# EasyEDA Pro project SCH_QF-HEYE迷你热成像仪V1.1.5-24-6-29_2025-11-29.eprj

# Board PCB_主板-0402_2025-11-29
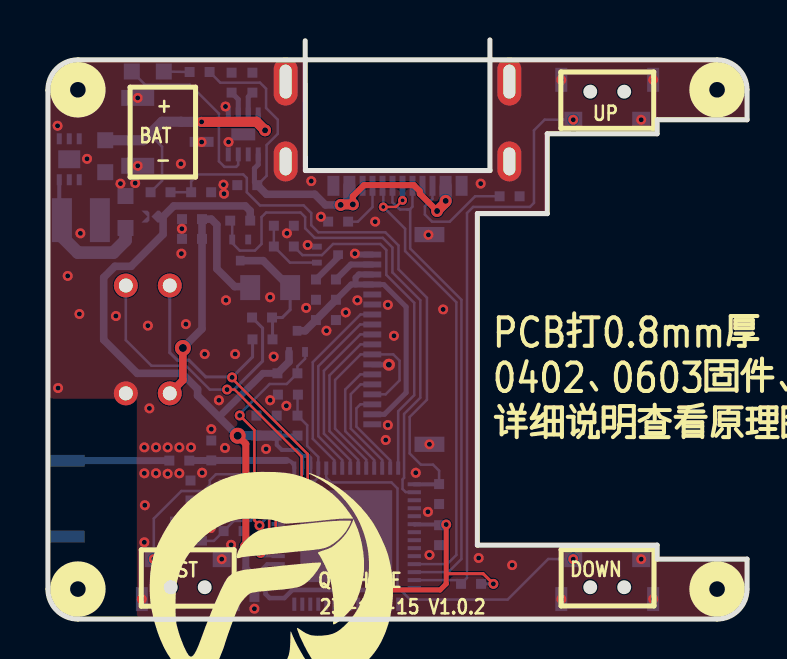
[diagram p0: board, top side]
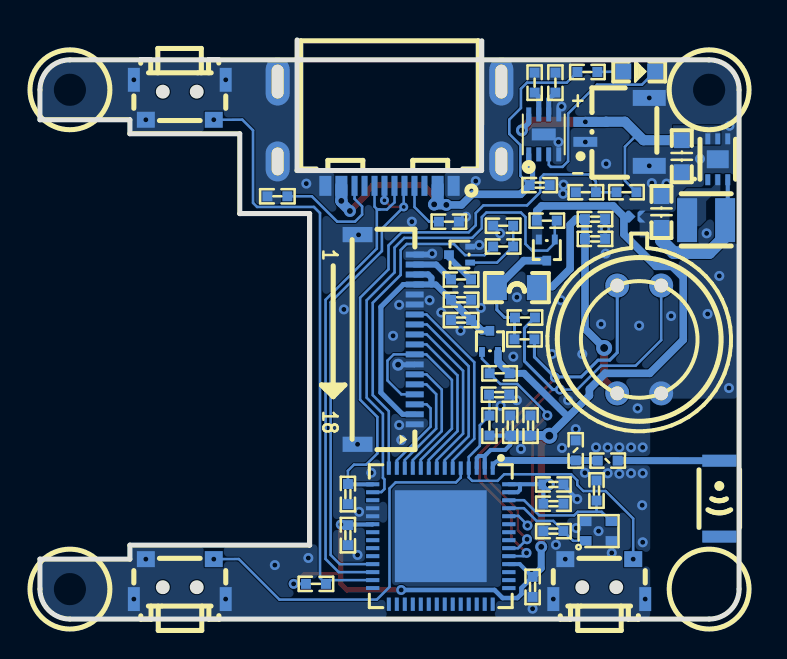
[diagram p1: board, bottom side, seen from below]

Outline 35 x 29 mm; copper layers: Top Layer, Bottom Layer. Coordinates in mm from the lower left corner of the outline.
Outline path: 0,26.48 arc(0.44,27.56) 1.52,28 33.5,28 arc(34.56,27.56) 35,26.5 35,25 30.5,25 30.5,24.3 25,24.3 25,20.3 21.5,20.3 21.5,3.7 30.5,3.7 30.5,3 35,3 35,1.5 arc(34.56,0.44) 33.5,0 1.5,0 arc(0.44,0.44) 0,1.5 0,26.48

## Design rules (mm)
via Default (default): diameter min 0.45, default 0.45, max 100.025; hole min 0.2, default 0.2, max 59.995
pour e378 uses gge41245
pour e379 uses gge65990
pour e512 uses gge41245(1)
pour e513 uses gge66092

## Placement (name value [footprint] x y rotation side)
C1  100nF  [CAP 0402]  7.21 19.03 180 bottom
C2  10uF  [CAP 0402]  7.21 20.02 180 bottom
C3  100nF  [CAP 0402]  13.92 15.99 180 bottom
C4  10uF  [CAP 0402]  13.92 14.97 0 bottom
C5  1uF  [CAP 0402]  9.98 21.73 180 bottom
C6  1uF  [CAP 0402]  12.01 11.24 180 bottom
C7  100nF  [CAP 0402]  10.44 9.69 90 bottom
C8  10uF  [CAP 0402]  11.46 9.69 90 bottom
C10  *  [CAP 0402]  9.3 4.4 0 bottom
C11  *  [CAP 0402]  7.14 6.44 270 bottom
C12  1uF  [CAP 0402]  9.3 5.78 0 bottom
C13  100nF  [CAP 0402]  10.34 1.61 270 bottom
C14  100nF  [CAP 0402]  19.58 6.26 270 bottom
C15  22u  [CAP 0603]  3.89 20.38 270 bottom
C16  100nF  [CAP 0402]  19.58 4.2 90 bottom
C17  22u  [CAP 0603]  2.87 23.17 90 bottom
C20  100nF  [CAP 0402]  9.3 6.74 0 bottom
CN3  SH1.0  [CONN-SMD_2P-P1.00_HDGC_HDGC1002WV-S-2P]  6.1 24.39 90 bottom
FPC3  0.5K-HX-18PWB  [FPC-SMD_18P-P0.50_HDGC_0.5K-HX-18PWB]  17.5 14 270 bottom
L2  -  [OA-C07]  0.99 6.03 270 bottom
L3  5.6nH  [L-0402]  6.58 7.93 0 bottom
L4  4.7nH  [L-0402]  8.18 8.44 90 bottom
L5  10uH  [0805-L]  11.12 16.6 0 bottom
L6  SWPA252012S4R7MT  [IND-SMD_L2.5-W2.0_SWPA252012S]  1.65 19.97 180 bottom
LED1  led-0603  [LED-0603]  5 27.42 0 bottom
Q1  CJ3134K  [SOT-723_L1.2-W0.8-P0.40-LS1.2-BR]  14 18.25 180 bottom
R1  1K  [RES-0402]  10.72 15.1 0 bottom
R2  1K  [RES-0402]  10.74 14 0 bottom
R3  6.2  [RES-0402]  11.81 18.65 180 bottom
R4  30k  [RES-0402]  11.81 19.69 0 bottom
R5  1K  [RES-0402]  7.59 27.39 180 bottom
R6  5.1K  [RES-0402]  14.53 19.9 180 bottom
R7  5.1K  [RES-0402]  23.11 21.17 180 bottom
R8  30k  [RES-0402]  21.18 1.76 0 bottom
R9  6.2  [RES-0402]  13.92 17 0 bottom
R11  300k  [RES-0402]  5.64 21.37 180 bottom
R12  30k  [RES-0402]  11.99 12.3 180 bottom
R13  30k  [RES-0402]  9.63 19.95 0 bottom
R14  680k  [RES-0402]  7.67 21.37 180 bottom
R15  62K  [RES-0402]  10.24 26.86 270 bottom
R16  470K  [RES-0402]  9.19 26.86 270 bottom
R55  10k  [RES-0402]  12.5 9.69 90 bottom
SW1  1TS003B  [KEY-SMD_1TS003B]  28 2 180 bottom
SW2  1TS003B  [KEY-SMD_1TS003B]  7 2 180 bottom
SW3  1TS003B  [KEY-SMD_1TS003B]  28 26 0 bottom
T1  SHORT_0.6  [SHORT-0.6]  5.23 20.15 0 bottom
U1  SGM6036-3.3  [UTDFN-6_L2.0-W1.5-P0.50-BL-EP]  1.07 23.02 180 bottom
U2  MLX90640ESF-BAB-000-TU  [TO-39-4_MELEXIS_MLX90640]  5 14 180 bottom
U3  ESP32-S3FH4R2  [QFN-56_L7.0-W7.0-P0.40-TL-EP4.6]  14.94 4.15 270 bottom
U4  CJ3139K  [SOT-723_L1.2-W0.8-P0.40-LS1.2-BR]  12.47 13.9 270 bottom
U6  CJ3139K  [SOT-723_L1.2-W0.8-P0.40-LS1.2-BR]  9.63 18.47 90 bottom
U7  SGM4056-6.8YTDE8G  [TDFN-8L_L2.0-W2.0-P0.50-BL-EP]  9.78 24.27 180 bottom
USB1  TYPE-C 16P CB0.8  [USB-C-SMD_TYPE-C-16P-CB0.8-073]  17.5 24.3 0 bottom
X1  40MHz  [2016_4P]  7.04 4.4 180 bottom

## Footprints (pads in the part's own frame, mm; a bottom-side part is the same pattern mirrored in y, then rotated)
0805-L
  rect 1x1.25 smd: 1(-1,0) 2(1,0)
2016_4P
  rect 0.575x0.475 smd: 1(-0.638,-0.488) 2(0.638,-0.488) 3(0.638,0.488) 4(-0.638,0.488)
CAP 0402
  rect 0.5x0.5 smd: 1(-0.5,0) 2(0.5,0)
CAP 0603
  rect 0.8x0.8 smd: 1(-0.8,0) 2(0.8,0)
CONN-SMD_2P-P1.00_HDGC_HDGC1002WV-S-2P
  rect 0.5x1.2 smd: 1(-0.5,1.6) 2(0.5,1.6)
  rect 0.8x1.651 smd: 3(1.7,-1.6) 4(-1.7,-1.6)
FPC-SMD_18P-P0.50_HDGC_0.5K-HX-18PWB
  rect 0.3x0.9 smd: 1(4.25,1.261) 2(3.75,1.261) 3(3.25,1.261) 4(2.75,1.261) 5(2.25,1.261) 6(1.75,1.261) 7(1.25,1.261) 8(0.75,1.261) 9(0.25,1.261) 10(-0.25,1.261) 11(-0.75,1.261) 12(-1.25,1.261) 13(-1.75,1.261) 14(-2.25,1.261) 15(-2.75,1.261) 16(-3.25,1.261) 17(-3.75,1.261) 18(-4.25,1.261)
  rect 0.762x1.5 smd: 19(-5.25,-1.6) 20(5.25,-1.6)
IND-SMD_L2.5-W2.0_SWPA252012S
  rect 1x2.2 smd: 1(-0.951,0) 2(0.951,0)
KEY-SMD_1TS003B
  rect 0.9x0.8 smd: 1(1.7,1) 2(-1.7,1)
  rect 0.6x1.2 smd: 3(-2.3,-1) 4(2.3,-1)
L-0402
  rect 0.5x0.5 smd: 1(-0.5,0) 2(0.5,0)
LED-0603
  rect 0.8x0.8 smd: 1(-0.8,0) 2(0.8,0)
OA-C07
  rect 0.6x1.7 smd: 1(-1.9,0) 2(1.9,0)
QFN-56_L7.0-W7.0-P0.40-TL-EP4.6
  rect 0.665x0.2 smd: 1(-3.408,2.6) 2(-3.408,2.2) 3(-3.408,1.8) 4(-3.408,1.4) 5(-3.408,1) 6(-3.408,0.6) 7(-3.408,0.2) 8(-3.408,-0.2) 9(-3.408,-0.6) 10(-3.408,-1) 11(-3.408,-1.4) 12(-3.408,-1.8) 13(-3.408,-2.2) 14(-3.408,-2.6) 29(3.408,-2.6) 30(3.408,-2.2) 31(3.408,-1.8) 32(3.408,-1.4) 33(3.408,-1) 34(3.408,-0.6) 35(3.408,-0.2) 36(3.408,0.2) 37(3.408,0.6) 38(3.408,1) 39(3.408,1.4) 40(3.408,1.8) 41(3.408,2.2) 42(3.408,2.6)
  rect 0.2x0.665 smd: 15(-2.599,-3.408) 16(-2.2,-3.408) 17(-1.8,-3.408) 18(-1.4,-3.408) 19(-1,-3.408) 20(-0.6,-3.408) 21(-0.2,-3.408) 22(0.2,-3.408) 23(0.6,-3.408) 24(1,-3.408) 25(1.401,-3.408) 26(1.8,-3.408) 27(2.2,-3.408) 28(2.6,-3.408) 43(2.6,3.408) 44(2.2,3.408) 45(1.8,3.408) 46(1.401,3.408) 47(1,3.408) 48(0.6,3.408) 49(0.2,3.408) 50(-0.2,3.408) 51(-0.6,3.408) 52(-1,3.408) 53(-1.4,3.408) 54(-1.8,3.408) 55(-2.2,3.408) 56(-2.599,3.408)
  rect 4.6x4.6 smd: 57(0,0)
RES-0402
  rect 0.5x0.5 smd: 1(-0.5,0) 2(0.5,0)
SHORT-0.6
  custom 0.4x0.6 smd: 1(-0.25,0)
  custom 0.5x0.6 smd: 2(0.25,0)
SOT-723_L1.2-W0.8-P0.40-LS1.2-BR
  rect 0.489x0.294 smd: 1(0.529,-0.4) 2(0.529,0.4)
  rect 0.489x0.434 smd: 3(-0.529,0)
TDFN-8L_L2.0-W2.0-P0.50-BL-EP
  rect 0.25x0.7 smd: 1(-0.75,-1) 2(-0.249,-1) 3(0.25,-1) 4(0.75,-1) 5(0.75,1) 6(0.25,1) 7(-0.249,1) 8(-0.75,1)
  rect 1.2x0.6 smd: 9(-0.001,-0.001)
TO-39-4_MELEXIS_MLX90640
  round 1.2 hole 0.7: 1(-1.1,2.7) 2(-1.1,-2.7) 3(1.1,-2.7) 4(1.1,2.7)
USB-C-SMD_TYPE-C-16P-CB0.8-073
  oval 1.2x2.4 hole 0.6x1.7: 0(-5.6,-2.611) 0(5.6,-2.611)
  oval 1.2x2 hole 0.6x1.4: 0(-5.6,1.389) 0(5.6,1.389)
  rect 0.6x1 smd: A1B12(-3.21,2.611) A4B9(-2.41,2.611) B1A12(3.21,2.611) B4A9(2.41,2.611)
  rect 0.3x1 smd: A5(-1.25,2.611) A6(-0.25,2.611) A7(0.251,2.61) A8(1.25,2.611) B5(1.75,2.611) B6(0.75,2.611) B7(-0.75,2.61) B8(-1.75,2.611)
UTDFN-6_L2.0-W1.5-P0.50-BL-EP
  rect 0.25x0.55 smd: 1(-0.5,-1.025) 2(-0.001,-1.025) 3(0.5,-1.025) 4(0.5,1.025) 5(-0.001,1.025) 6(-0.5,1.025)
  rect 1.1x0.9 smd: 7(-0.001,0)

## Nets
3V3: C7.1 C8.1 C12.2 C13.1 C16.2 C20.2 R8.2 R12.2 R13.2 R55.1 T1.2 U3.2 U3.3 U3.20 U3.46 U3.55 U3.56 U4.2 U6.2
+5V: C5.1 R5.1 U7.1 USB1.A4B9 USB1.B4A9
GND: C1.2 C2.2 C3.2 C4.2 C5.2 C6.2 C7.2 C8.2 C10.2 C11.1 C12.1 C13.2 C14.2 C15.1 C16.1 C17.1 C20.1 CN3.1 CN3.3 CN3.4 FPC3.1 FPC3.7 FPC3.13 FPC3.14 FPC3.18 FPC3.19 FPC3.20 L4.2 Q1.2 R4.2 R6.2 R7.1 R14.1 R15.1 R16.1 SW1.2 SW1.3 SW1.4 SW2.2 SW2.3 SW2.4 SW3.1 SW3.3 SW3.4 U1.4 U1.7 U2.3 U3.18 U3.19 U3.57 U7.4 U7.5 U7.9 USB1.0 USB1.A1B12 USB1.B1A12 X1.2 X1.4
ADC: C14.1 R11.1 R14.2 U3.15
BAT: C17.2 CN3.2 R11.2 U1.5 U1.6 U7.8
BLK: R3.1 U3.14
C1_1: C1.1 C2.1 L5.1 U2.2
C3_1: C3.1 C4.1 FPC3.2 FPC3.15 FPC3.16 U4.3
C15_2: C15.2 L6.2 T1.1 U1.3
CAM_VDD: R13.1 U3.16 U6.1
CHA: LED1.1 U7.3
CS: FPC3.11 U3.7
DC: FPC3.12 U3.6
FPC3_17: FPC3.17 R9.2
IO0: SW1.1 U3.5
KEY: R8.1 SW3.2 U3.27
L3_1: L2.1 L3.1
L6_1: L6.1 U1.2
L_RST: FPC3.4 FPC3.8 U3.10
LCD_VDD: R12.1 U3.52 U4.1
LNA: L3.2 L4.1 U3.1
MOSI: FPC3.9 U3.9
Q1_1: Q1.1 R3.2 R4.1
Q1_3: Q1.3 R9.1
R1_2: L5.2 R1.2 R2.2 U6.3
R5_2: LED1.2 R5.2
RST: C6.1 R55.2 SW2.1 U3.4
SCL: R1.1 U2.4 U3.48
SCLK: FPC3.10 U3.8
SDA: R2.1 U2.1 U3.47
TP_INT: FPC3.3 U3.13
TP_SCL: FPC3.6 U3.11
TP_SDA: FPC3.5 U3.12
U7_6: R16.2 U7.6
U7_7: R15.2 U7.7
USB1_A5: R6.1 USB1.A5
USB1_B5: R7.2 USB1.B5
USB_D+: U3.26 USB1.A6 USB1.B6
USB_D-: U3.25 USB1.A7 USB1.B7
XTAL_N: C10.1 U3.53 X1.1
XTAL_P: C11.2 U3.54 X1.3

Pads without a net: L2 2; U1 1; U3 17 21 22 23 24 28 29 30 31 32 33 34 35 36 37 38 39 40 41 42 43 44 45 49 50 51; U7 2; USB1 A8 B8

## Via types
v1: diameter 0.5, hole 0.25, Top Layer to Bottom Layer, 96 vias
v2: diameter 0.8, hole 0.4, Top Layer to Bottom Layer, 2 vias
v3: diameter 0.6, hole 0.3, Top Layer to Bottom Layer, 8 vias
v4: diameter 0.45, hole 0.2, Top Layer to Bottom Layer, 2 vias

## Routing (per net, layer and track width the routed paths; a pad name or vN(x,y) marks a point on that pad's centre or on a via; arc(x,y) is an arc through that point)
3V3: length 66.2
  Top Layer w0.152: 19.94,1.97 19.94,2.27 21.79,2.27 v1(22.3,1.76)
  Top Layer w0.254: v1(16.92,1.46) 19.63,1.46 19.94,1.76 v1(19.94,4.73)
  Top Layer w0.349: v3(9.91,3.62) 9.91,6.36 v3(9.53,6.74) 9.91,7.12 9.91,8.77 v2(9.5,9.18)
  Bottom Layer w0.152: R8.2 v1(22.3,1.76)
  Bottom Layer w0.203: R55.1 C8.1 11.46,8.72 11.71,8.47 12.44,8.47 12.74,8.17 ; 12.74,8.17 U3.2 ; 12.74,8.17 12.66,8.25 ; 12.74,8.17 13.03,8.17 13.13,8.06 13.13,7.56 ; 11.53,6.35 11.08,6.35 10.97,6.47 10.97,6.75 ; v1(19.94,4.73) 18.36,4.73 18.34,4.75 ; U3.56 9.53,6.75 v3(9.53,6.74) C20.2 C12.2 ; U3.46 10.98,2.75 C13.1
  Bottom Layer w0.229: v1(16.92,1.46) 12.24,1.46 11.84,1.05 11.1,1.05 10.9,1.25 10.9,1.55 C13.1
  Bottom Layer w0.254: 19.58,4.75 19.6,4.73 v1(19.94,4.73)
  Bottom Layer w0.349: v3(9.91,3.62) 9.91,2.54 C13.1 ; C20.2 v3(9.53,6.74) ; 8.61,10.17 10.77,12.3 R12.2
  Bottom Layer w0.381: R12.2 12.07,12.88 12.07,13.37 ; 10.13,19.95 10.13,20.44 9.88,20.69 6.3,20.69 5.77,20.15 5.77,19.26 4.17,17.66 3.35,17.66 2.79,17.1 2.79,13.98 4.47,12.3 6.71,12.3 7.49,11.52 7.49,11.19 v2(9.5,9.18)
  Bottom Layer w0.457: C7.1 9.51,9.19 v2(9.5,9.18)
  Bottom Layer w0.508: C8.1 C7.1
+5V: length 25.4
  Top Layer w0.305: v3(15.27,20.76) 15.27,21.17 15.82,21.73 18.31,21.73 18.62,21.42 18.62,21.29 v3(19.48,20.43)
  Top Layer w0.508: v3(15.27,20.76) 14.68,20.76 v3(14.66,20.74) ; v3(19.48,20.43) 19.91,20.86 v3(19.91,20.94)
  Bottom Layer w0.127: 8.09,27.39 8.63,26.86 10.62,26.86 10.92,26.55 10.92,25.59 11.51,25 11.51,24.29 10.95,23.73 10.95,22.19 C5.1
  Bottom Layer w0.254: U7.1 10.53,22.75 10.34,22.56 10.34,21.87 C5.1
  Bottom Layer w0.305: v3(14.66,20.74) 14.68,20.76 v3(15.27,20.76)
  Bottom Layer w0.381: v3(14.66,20.74) 13.89,20.74 13.36,21.27 10.94,21.27 C5.1
  Bottom Layer w0.508: v3(15.27,20.76) 14.68,20.76 v3(14.66,20.74) ; v3(19.91,20.94) 19.91,20.86 v3(19.48,20.43)
  Bottom Layer w0.61: 15.09,21.69 15.09,20.94 v3(15.27,20.76) ; v3(19.91,20.94) 19.91,20.94 19.91,21.69
GND: length 2.8
  Bottom Layer w0.203: v1(8.1,6) 8.8,6.7 C20.1
  Bottom Layer w0.254: FPC3.7 16.25,12.73 v3(17.07,12.73)
  Bottom Layer w0.305: 16.24,18.25 15.37,18.25 v1(15.37,18.3)
  vias: v1(0.48,24.7) v1(0.51,11.57) v1(0.99,17.18) v1(1.63,19.31) v1(1.57,15.27) v1(1.96,23.04) v1(3.4,15.17) v1(3.63,21.8) v1(4.37,21.83) v1(4.5,26.09) v1(4.5,22.69) v1(4.7,1) v1(4.83,8.59) v1(4.83,7.3) v1(4.83,3.84) v1(4.85,5.7) v1(5,14.69) v1(5.08,10.55) v1(5.41,8.59) v1(5.41,7.3) v1(5.99,8.59) v1(5.99,7.27) v1(6.38,3.31) v1(6.58,8.59) v1(6.58,7.3) v1(6.66,22.79) v1(6.71,19.54) v1(6.68,18.3) v1(6.91,14.77) v1(7.04,4.4) v1(7.16,8.59) v1(7.7,23.89) v1(7.72,7.32) v1(7.85,13.27) v1(8.18,9.51) v1(8.15,4.56) v1(8.56,10.96) v1(8.7,3) v1(8.79,21.75) v1(8.81,21.29) v1(8.89,25.66) v1(8.92,15.96) v1(8.86,8.57) v1(9.04,23.89) v1(9.17,3.72) v1(9.3,1) v1(9.37,13.27) v1(10.34,0.52) v1(10.92,8.52) v1(11.12,16.11) v1(11.12,10.96) v1(11.3,13.14) v1(11.94,10.68) v1(11.96,19.31) v1(12.93,15.58) v1(13,18.73) v1(13.18,21.93) v1(13.66,20.14) v1(13.94,14.44) v1(14.91,15.35) v1(15.49,15.96) v1(16.38,19.9) v1(16.91,8.97) v1(17.02,15.73) v1(17.02,9.71) v1(17.32,14.18) v1(18.41,7.32) v1(19.02,5.37) v1(19.05,19.24) v1(19.1,8.75) v1(19.1,3.21) v1(19.79,15.5) v1(21.56,3.06) v1(21.67,21.8) v1(23.24,2.7) v1(25.7,27) v1(25.71,1) v1(29.7,25) v1(29.7,3) v1(30.3,27) v1(30.3,1)
ADC: length 29.4
  Bottom Layer w0.127: 6.14,21.37 7.17,21.37 7.17,21.91 7.52,22.26 9.78,22.26 9.96,22.08 9.96,21.37 10.62,20.71 12.8,20.71 13.18,20.33 13.18,19.72 13.54,19.36 16.89,19.36 17.55,18.7 17.55,17.51 18.97,16.09 18.97,10.98 18.11,10.12 18.11,8.29 18.67,7.73 19.28,7.73 19.58,7.43 C14.1
  Bottom Layer w0.203: 18.34,6.74 19.58,6.75
BAT: length 12.9
  Top Layer w0.508: v3(10.87,24.47) 10.44,24.9 v1(7.7,24.89)
  Bottom Layer w0.127: 5.09,24.28 5.72,23.65 5.72,21.95 5.14,21.37
  Bottom Layer w0.254: v3(10.87,24.47) 10.87,24.49 10.53,24.84 U7.8
  Bottom Layer w0.508: v1(7.7,24.89) 6.66,24.89 6.66,24.9 5.72,24.9 4.79,23.97 C17.2
BLK: length 17
  Bottom Layer w0.127: R3.1 12.74,18.22 13.72,18.22 14.28,18.78 16.64,18.78 16.94,18.47 16.94,17.23 18.34,15.83 18.34,11.21 17.54,10.41 U3.14
C1_1: length 14.5
  Top Layer w0.381: U2.2 6.76,11.96 v2(6.76,13.57)
  Bottom Layer w0.381: v2(6.76,13.57) 7.71,14.53 C1.1 C2.1 8.18,20.02 8.46,19.75 8.46,17.53 9.35,16.65 10.07,16.65 L5.1
C3_1: length 14.6
  Bottom Layer w0.254: 16.24,10.25 16.85,10.25 17.93,11.34 17.93,15.63 16.81,16.75 16.24,16.75
  Bottom Layer w0.305: C3.1 15.18,16.75 16.24,16.75 ; 15.4,16.75 15.4,17.09 15.57,17.26 16.24,17.25
  Bottom Layer w0.381: U4.3 12.88,14.43 C4.1 C3.1
C15_2: length 7.3
  Bottom Layer w0.203: L6.2 0.57,20.11 U1.3
  Bottom Layer w0.635: L6.2 0.7,19.15 1.5,18.35 3.28,18.35 3.89,18.96 C15.2
CAM_VDD: length 25.7
  Bottom Layer w0.127: R13.1 9.23,19.95 U6.1 9.23,18.83 9.6,18.45 10.36,18.45 10.69,18.78 10.69,20.13 10.92,20.35 12.65,20.35 12.88,20.13 12.88,19.57 13.36,19.08 16.76,19.08 17.25,18.6 17.25,17.36 18.64,15.96 18.64,11.08 17.83,10.27 17.83,7.07 17.75,6.99 17.75,6.51 17.91,6.36 18.34,6.35
CHA: length 9.3
  Bottom Layer w0.127: U7.3 9.53,22.74 9.42,22.64 8.84,22.64 8.56,22.92 8.56,25.31 7.11,26.76 4.86,26.76 LED1.1
CS: length 9.2
  Bottom Layer w0.127: 14.73,7.56 14.73,7.96 13.54,9.15 13.54,12.66 15.63,14.75 16.24,14.75
DC: length 9.7
  Bottom Layer w0.127: U3.6 14.34,7.95 13.26,9.03 13.26,12.86 15.65,15.25 16.24,15.25
FPC3_17: length 2.1
  Bottom Layer w0.305: R9.2 15.17,17.75 FPC3.17
IO0: length 19.1
  Bottom Layer w0.127: v1(26.3,3) 25.04,3.01 23.01,0.97 18.14,0.97 17.5,1.61 17.5,6.54 17.2,6.84 14.17,6.84 13.93,7.08 13.93,7.56
KEY: length 30.5
  Bottom Layer w0.127: 18.34,1.95 20.5,1.95 R8.1 20.98,2.06 20.98,20.33 21.28,20.63 24.13,20.63 24.33,20.84 24.33,24.47 24.87,25 v1(26.3,25)
L3_1: length 5.1
  Bottom Layer w0.349: L3.1 L2.1
L_RST: length 11.6
  Bottom Layer w0.127: U3.10 15.94,7.97 14.38,9.53 14.38,11.97 15.65,13.25 17.29,13.25 17.6,12.94 17.6,11.95 16.91,11.25 16.24,11.25
LCD_VDD: length 12.1
  Top Layer w0.127: v1(10.59,4.68) 10.34,4.94 10.34,9.46 v1(9.6,10.19)
  Bottom Layer w0.127: v1(10.59,4.68) 10.59,4.71 11.05,5.17 U3.52 ; U4.1 12.87,13.03 12.49,12.65 R12.1 11.96,11.77 11.1,11.77 9.6,10.27 v1(9.6,10.19)
LNA: length 5.5
  Bottom Layer w0.203: U3.1 arc(12.22,7.83) 11.95,7.94
  Bottom Layer w0.349: 11.95,7.94 L4.1 7.08,7.93
MOSI: length 8
  Bottom Layer w0.127: 16.24,13.75 15.65,13.75 14.1,12.2 14.1,9.41 15.53,7.97 15.53,7.56
Q1_1: length 3.5
  Bottom Layer w0.127: Q1.1 12.12,17.85 R3.2 ; 11.31,19.69 11.31,18.65
Q1_3: length 1.7
  Bottom Layer w0.305: R9.1 14.53,18.11 Q1.3
R1_2: length 6.3
  Bottom Layer w0.152: R2.2 11.24,15.07 R1.2 11.74,15.1 12.13,15.49 12.13,16.6
  Bottom Layer w0.381: L5.2 10.78,17.95 U6.3
R5_2: length 1.3
  Bottom Layer w0.127: R5.2 LED1.2
RST: length 16.1
  Bottom Layer w0.127: v1(5.3,3) 5.3,5.03 6.68,6.41 7.8,6.41 8.1,6.72 8.1,6.94 8.41,7.25 11.76,7.25 12.09,6.92 13.36,6.92 13.54,7.09 U3.4 13.54,8.11 12.98,8.67 12.98,9.7 12.5,10.19 ; R55.2 12.5,11.22 C6.1
SCL: length 24.8
  Top Layer w0.127: v1(8.97,11.49) 9.35,11.49 12.7,8.14 12.7,7.1 11.07,5.47 11.07,4.45 v1(10.62,4)
  Bottom Layer w0.127: 11.53,3.55 11.06,3.55 v1(10.62,4) ; v1(8.97,11.49) 8.1,11.49 6.91,12.68 5.18,12.68 3.9,13.97 U2.4
  Bottom Layer w0.152: R1.1 10.75,14.57 10.75,12.91 9.32,11.49 v1(8.97,11.49)
SCLK: length 8.6
  Bottom Layer w0.127: 16.24,14.25 15.64,14.25 13.82,12.43 13.82,9.28 15.14,7.96 U3.8
SDA: length 21.6
  Top Layer w0.127: v1(9.22,12.1) 9.22,12.05 13,8.26 13,6.92 11.4,5.32 11.4,4.07 v1(10.64,3.31)
  Bottom Layer w0.127: v1(10.64,3.31) 10.8,3.15 U3.47
  Bottom Layer w0.152: R2.1 10.24,13.12 v1(9.22,12.1) 9.19,12.12 7.9,12.12 7.06,12.96 6.48,12.96 6.1,13.34 U2.1
TP_INT: length 4.6
  Bottom Layer w0.127: 16.24,10.75 15.64,10.75 15.44,10.55 15.44,9.64 17.13,7.94 U3.13
TP_SCL: length 6.2
  Bottom Layer w0.127: 16.24,12.25 15.64,12.25 14.88,11.49 14.88,9.41 16.33,7.96 16.33,7.56
TP_SDA: length 5.6
  Bottom Layer w0.127: U3.12 16.74,7.96 15.16,9.53 15.16,11.26 15.65,11.75 16.24,11.75
U7_6: length 1.2
  Bottom Layer w0.254: U7.6 9.53,26.02 R16.2
U7_7: length 1.2
  Bottom Layer w0.254: U7.7 10.03,26.15 R15.2
USB1_A5: length 2.8
  Bottom Layer w0.127: 16.25,21.86 16.25,20.63 15.52,19.9 R6.1
USB1_B5: length 6.2
  Bottom Layer w0.127: 19.25,21.86 19.25,21.04 18.87,20.66 18.87,20.25 19.23,19.9 20.12,19.9 21.39,21.17 R7.2
USB_D+: length 24.8
  Bottom Layer w0.127: 18.25,21.86 18.25,20.65 18.11,20.51 17.98,20.51 ; 18.34,2.35 20.04,2.35 20.7,3.01 20.7,15.99 18.14,18.55 18.14,20.51 17.63,20.51 17.25,20.86 17.25,21.86
USB_D-: length 24.5
  Top Layer w0.127: v4(16.79,20.63) 17.42,20.63 v4(17.75,20.96)
  Bottom Layer w0.127: 16.75,21.86 16.79,21.82 v4(16.79,20.63) 17.88,19.54 17.88,18.42 20.45,15.86 20.45,3.21 19.99,2.75 18.34,2.75
  Bottom Layer w0.152: v4(17.75,20.96) 17.75,21.86 17.75,21.86
XTAL_N: length 4.5
  Bottom Layer w0.127: X1.1 8.31,3.92 C10.1 9.3,4.91 10.13,4.91 10.77,5.55 11.53,5.55
XTAL_P: length 6.3
  Bottom Layer w0.127: X1.3 6.88,5.37 8.08,5.37 8.25,5.19 10.01,5.19 10.77,5.95 U3.54 ; C11.2 7.13,5.37

## Copper pours and planes (outline as drawn; the poured copper is in the pictures)
GND on Top Layer: -1.27,29.78 35.48,29.78 36.55,30.84 36.55,-2.4 35.76,-3.19 0.86,-3.19 -2.34,0.01
GND on Bottom Layer: -2.1,30.63 37.02,30.63 37.81,29.84 37.81,-0.18 35.22,-2.77 -0.09,-2.77 -2.1,-0.77
1111 on Top Layer: 0,-0.17 0,10.98 4.34,10.98 4.39,10.93 4.39,-0.09
1111 on Bottom Layer: 0,-0.17 0,10.98 4.34,10.98 4.39,10.93 4.39,-0.09
BAT on Bottom Layer: 0.94,24.72 3.3,24.72 3.3,23.76 0.94,23.76
C15_2 on Bottom Layer: 3.48,20.35 4.98,20.35 4.98,19.11 3.48,19.11
L6_1 on Bottom Layer: 0.94,22.28 3.12,22.28 3.12,19.67 0.94,19.67

Small or netless copper shapes (teardrops, artwork), in the pictures only: 1 on Bottom Layer

## Text on the board
Bottom Silkscreen Layer: 1 | 18 | + | -
Top Silkscreen Layer: BAT | - | + | RST | QF-HEYE | 23-12-15 V1.0.2 | DOWN | UP | 0402、0603固件、外壳通用 | PCB打0.8mm厚 | 详细说明查看原理图和用户手册！

# Board PCB_主板-0603_2025-11-29
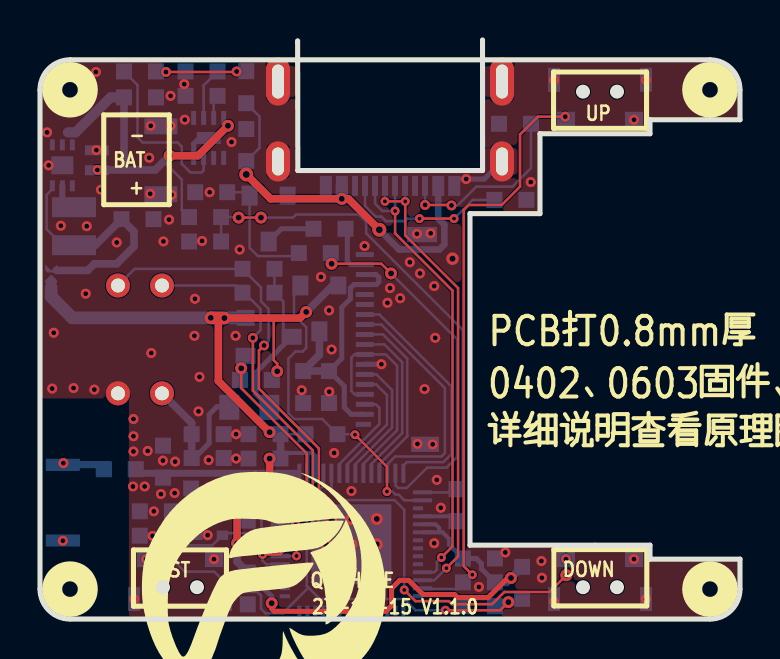
[diagram p2: board, top side]
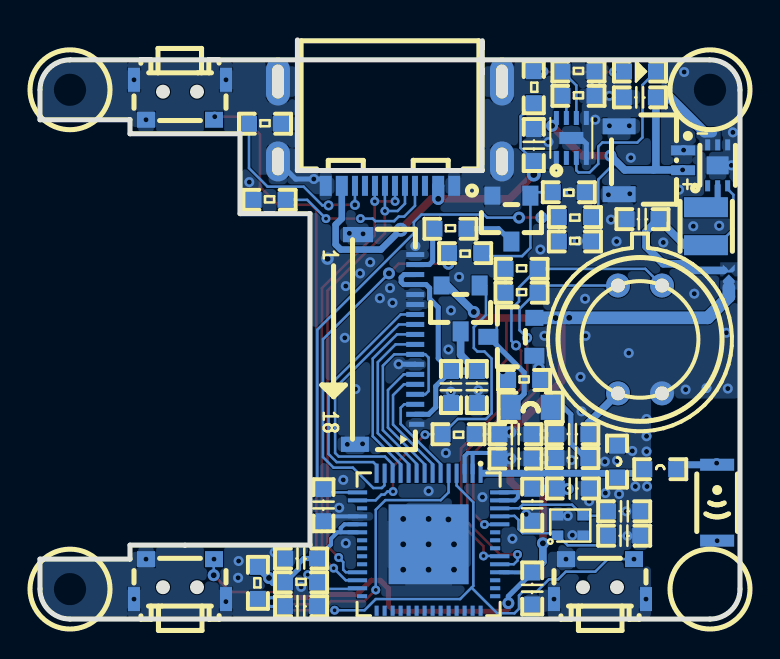
[diagram p3: board, bottom side, seen from below]

Outline 35 x 29 mm; copper layers: Top Layer, Bottom Layer. Coordinates in mm from the lower left corner of the outline.
Outline path: 0,26.48 arc(0.44,27.56) 1.52,28 33.5,28 arc(34.56,27.56) 35,26.5 35,25 30.5,25 30.5,24.3 25,24.3 25,20.3 21.5,20.3 21.5,3.7 30.5,3.7 30.5,3 35,3 35,1.5 arc(34.56,0.44) 33.5,0 1.5,0 arc(0.44,0.44) 0,1.5 0,26.48
Stack: Top Layer 0.035mm / Dielectric1 1.51mm FR4 er 4.5 / Bottom Layer 0.035mm

## Design rules (mm)
spacing Default (default): track to track 0.127, other pairs 0 to 0.127
track width Default (default): min 0.127, default 0.127, max 25.4
differential pair differentialPair (default): width min 0.127, default 0.254, max 2.54; gap min 0.152, default 0.152
via Default (default): diameter min 0.45, default 0.45, max 100.025; hole min 0.2, default 0.2, max 59.995
pour e357 uses gge41245
pour e362 uses gge82436
pour e512 uses gge41245(1)
pour e513 uses gge82526

## Placement (name value [footprint] x y rotation side)
C1  100nF  [CAP 0603]  8.38 9.25 0 bottom
C2  10uF  [CAP 0603]  8.38 8.06 0 bottom
C3  100nF  [CAP 0603]  14.45 11.62 270 bottom
C4  10uF  [CAP 0603]  13.16 11.62 270 bottom
C5  1uF  [CAP 0603]  10.31 23.73 90 bottom
C6  1uF  [CAP 0603]  21.95 0.64 180 bottom
C7  100nF  [CAP 0603]  11.23 8.04 180 bottom
C8  10uF  [CAP 0603]  11.23 9.25 180 bottom
C10  *  [CAP 0603]  5.79 4.17 180 bottom
C11  *  [CAP 0603]  5.79 5.39 0 bottom
C12  1uF  [CAP 0603]  10.39 5.72 90 bottom
C13  100nF  [CAP 0603]  10.39 1.53 270 bottom
C14  100nF  [CAP 0603]  20.83 5.7 270 bottom
C15  22u  [CAP 0603]  4.88 20.02 180 bottom
C16  100nF  [CAP 0603]  21.95 3.03 180 bottom
C17  22u  [CAP 0603]  5 26.12 180 bottom
C20  100nF  [CAP 0603]  8.36 6.54 0 bottom
CN3  SH1.0  [CONN-SMD_2P-P1.00_HDGC_HDGC1002WV-S-2P]  4.44 22.97 270 bottom
FPC3  0.5K-HX-18PWB  [FPC-SMD_18P-P0.50_HDGC_0.5K-HX-18PWB]  17.5 14 270 bottom
L2  -  [OA-C07]  1.14 5.83 270 bottom
L3  5.6nH  [L-0603]  3.99 7.5 0 bottom
L4  4.7nH  [L-0603]  6.15 7.88 90 bottom
L5  10uH  [0805-L]  10.47 10.6 0 bottom
L6  SWPA252012S4R7MT  [IND-SMD_L2.5-W2.0_SWPA252012S]  1.7 19.67 270 bottom
LED1  led-0603  [LED-0603]  5 27.42 0 bottom
Q1  CJ3134K  [SOT-23_L2.9-W1.3-P1.90-LS2.4-BR]  11.43 20.05 90 bottom
R1  1K  [RES-0603]  10.92 17.53 0 bottom
R2  1K  [RES-0603]  10.92 16.34 0 bottom
R3  6.2  [RES-0603]  13.74 18.32 180 bottom
R4  30k  [RES-0603]  8.56 21.37 180 bottom
R5  1K  [RES-0603]  10.31 26.63 90 bottom
R6  5.1K  [RES-0603]  23.52 20.99 0 bottom
R7  5.1K  [RES-0603]  23.75 24.8 0 bottom
R8  30k  [RES-0603]  21.95 1.84 0 bottom
R9  6.2  [RES-0603]  14.48 19.54 0 bottom
R11  300k  [RES-0603]  8.25 20.13 180 bottom
R12  30k  [RES-0603]  14.07 9.25 180 bottom
R13  30k  [RES-0603]  10.79 11.97 0 bottom
R14  680k  [RES-0603]  8.25 18.91 0 bottom
R15  62K  [RES-0603]  8.08 26.2 0 bottom
R16  470K  [RES-0603]  8.08 27.42 0 bottom
R55  10k  [RES-0603]  24.1 1.81 270 bottom
SW1  1TS003B  [KEY-SMD_1TS003B]  28 2 180 bottom
SW2  1TS003B  [KEY-SMD_1TS003B]  7 2 180 bottom
SW3  1TS003B  [KEY-SMD_1TS003B]  28 26 0 bottom
T1  SHORT_0.6  [SHORT-0.6]  0.56 17.2 270 bottom
U1  SGM6036-3.3  [UTDFN-6_L2.0-W1.5-P0.50-BL-EP]  1.12 22.72 180 bottom
U2  MLX90640ESF-BAB-000-TU  [TO-39-4_MELEXIS_MLX90640]  5 14 180 bottom
U3  ESP32-S3FH4R2  [QF-HEYE-ESP]  15.57 3.74 270 bottom
U4  CJ3139K  [SOT-23_L2.9-W1.3-P1.90-LS2.4-BR]  13.97 15.55 90 bottom
U6  CJ3139K  [SOT-23_L2.9-W1.3-P1.90-LS2.4-BR]  11.43 14.13 180 bottom
U7  SGM4056-6.8YTDE8G  [TDFN-8L_L2.0-W2.0-P0.50-BL-EP]  8.43 24.09 180 bottom
USB1  TYPE-C 16P CB0.8  [USB-C-SMD_TYPE-C-16P-CB0.8-073]  17.5 24.3 0 bottom
X1  40MHz  [2016_4P]  8.48 4.68 180 bottom

## Footprints (pads in the part's own frame, mm; a bottom-side part is the same pattern mirrored in y, then rotated)
0805-L
  rect 1x1.25 smd: 1(-1,0) 2(1,0)
2016_4P
  rect 0.575x0.475 smd: 1(-0.638,-0.488) 2(0.638,-0.488) 3(0.638,0.488) 4(-0.638,0.488)
CAP 0603
  rect 0.8x0.8 smd: 1(-0.8,0) 2(0.8,0)
CONN-SMD_2P-P1.00_HDGC_HDGC1002WV-S-2P
  rect 0.5x1.2 smd: 1(-0.5,1.6) 2(0.5,1.6)
  rect 0.8x1.651 smd: 3(1.7,-1.6) 4(-1.7,-1.6)
FPC-SMD_18P-P0.50_HDGC_0.5K-HX-18PWB
  rect 0.254x0.762 smd: 1(4.25,1.333)
  rect 0.254x0.9 smd: 2(3.75,1.261) 3(3.25,1.261) 4(2.75,1.261) 5(2.25,1.261) 6(1.75,1.261) 7(1.25,1.261) 8(0.75,1.261) 9(0.25,1.261) 10(-0.25,1.261) 11(-0.75,1.261) 12(-1.25,1.261) 13(-1.75,1.261) 14(-2.25,1.261) 15(-2.75,1.261) 16(-3.25,1.261) 17(-3.75,1.261) 18(-4.25,1.261)
  rect 0.762x1.5 smd: 19(-5.25,-1.6)
  rect 0.762x1.397 smd: 20(5.25,-1.753)
IND-SMD_L2.5-W2.0_SWPA252012S
  rect 1x2.2 smd: 1(-0.951,0) 2(0.951,0)
KEY-SMD_1TS003B
  rect 0.9x0.8 smd: 1(1.7,1) 2(-1.7,1)
  rect 0.6x1.2 smd: 3(-2.3,-1) 4(2.3,-1)
L-0603
  rect 0.8x0.8 smd: 1(-0.8,0) 2(0.8,0)
LED-0603
  rect 0.8x0.8 smd: 1(-0.8,0) 2(0.8,0)
OA-C07
  rect 0.6x1.7 smd: 1(-1.9,0) 2(1.9,0)
QF-HEYE-ESP
  rect 0.965x0.2 smd: 1(-3.556,2.6) 2(-3.556,2.2) 3(-3.556,1.8) 4(-3.556,1.4) 5(-3.556,1) 6(-3.556,0.6) 7(-3.556,0.2) 8(-3.556,-0.2) 9(-3.556,-0.6) 10(-3.556,-1) 11(-3.556,-1.4) 12(-3.556,-1.8) 13(-3.556,-2.2) 14(-3.556,-2.6)
  rect 0.2x0.965 smd: 15(-2.6,-3.557) 16(-2.2,-3.557) 18(-1.4,-3.557) 19(-1,-3.557) 20(-0.6,-3.557) 25(1.4,-3.557) 26(1.8,-3.557) 27(2.2,-3.557) 46(1.4,3.555) 47(1,3.555) 48(0.6,3.555) 52(-1,3.555) 53(-1.4,3.555) 54(-1.8,3.555) 55(-2.2,3.555) 56(-2.6,3.555)
  rect 0.2x0.508 smd: 17(-1.8,-3.328) 21(-0.2,-3.328) 22(0.2,-3.328) 23(0.6,-3.328) 24(1,-3.328) 28(2.6,-3.328) 43(2.6,3.328) 44(2.2,3.328) 45(1.8,3.328) 49(0.2,3.328) 50(-0.2,3.328) 51(-0.6,3.328)
  rect 0.508x0.2 smd: 29(3.328,-2.6) 30(3.328,-2.2) 31(3.328,-1.8) 32(3.328,-1.4) 33(3.328,-1) 34(3.328,-0.6) 35(3.328,-0.2) 36(3.328,0.2) 37(3.328,0.6) 38(3.328,1) 39(3.328,1.4) 40(3.328,1.8) 41(3.328,2.2) 42(3.328,2.6)
  rect 4x4 smd: 57(0,0)
RES-0603
  rect 0.8x0.8 smd: 1(-0.8,0) 2(0.8,0)
SHORT-0.6
  custom 0.4x0.6 smd: 1(-0.25,0)
  custom 0.5x0.6 smd: 2(0.25,0)
SOT-23_L2.9-W1.3-P1.90-LS2.4-BR
  rect 1x0.8 smd: 1(1.15,-0.95) 3(-1.15,0)
  rect 0.9x0.8 smd: 2(1.15,0.95)
TDFN-8L_L2.0-W2.0-P0.50-BL-EP
  rect 0.25x0.7 smd: 1(-0.75,-1) 2(-0.249,-1) 3(0.25,-1) 4(0.75,-1) 5(0.75,1) 6(0.25,1) 7(-0.249,1) 8(-0.75,1)
  rect 1.2x0.6 smd: 9(-0.001,-0.001)
TO-39-4_MELEXIS_MLX90640
  round 1.2 hole 0.7: 1(-1.1,2.7) 2(-1.1,-2.7) 3(1.1,-2.7) 4(1.1,2.7)
USB-C-SMD_TYPE-C-16P-CB0.8-073
  oval 1.2x2.4 hole 0.6x1.7: 0(-5.6,-2.611) 0(5.6,-2.611)
  oval 1.2x2 hole 0.6x1.4: 0(-5.6,1.389) 0(5.6,1.389)
  rect 0.6x1 smd: A1B12(-3.21,2.611) A4B9(-2.41,2.611) B1A12(3.21,2.611) B4A9(2.41,2.611)
  rect 0.3x1 smd: A5(-1.25,2.611) A6(-0.25,2.611) A7(0.251,2.61) A8(1.25,2.611) B5(1.75,2.611) B6(0.75,2.611) B7(-0.75,2.61) B8(-1.75,2.611)
UTDFN-6_L2.0-W1.5-P0.50-BL-EP
  rect 0.25x0.55 smd: 1(-0.5,-1.025) 2(0,-1.025) 3(0.5,-1.025) 4(0.5,1.025) 5(0,1.025) 6(-0.5,1.025)
  rect 1.1x0.9 smd: 7(0,0)

## Nets
3V3: C7.1 C8.1 C12.2 C13.1 C16.2 C20.2 R8.2 R12.2 R13.2 R55.1 T1.2 U3.2 U3.3 U3.19 U3.20 U3.46 U3.55 U3.56 U4.2 U6.2
+5V: C5.1 R5.1 U7.1 USB1.A4B9 USB1.B4A9
GND: C1.2 C2.2 C3.2 C4.2 C5.2 C6.2 C7.2 C8.2 C10.2 C11.1 C12.1 C13.2 C14.2 C15.1 C16.1 C17.1 C20.1 CN3.1 CN3.3 CN3.4 FPC3.1 FPC3.7 FPC3.13 FPC3.14 FPC3.18 FPC3.19 FPC3.20 L4.2 Q1.2 R4.2 R6.2 R7.1 R14.1 R15.1 R16.1 SW1.2 SW1.3 SW1.4 SW2.2 SW2.3 SW2.4 SW3.1 SW3.3 SW3.4 U1.4 U1.7 U2.3 U3.18 U3.57 U7.4 U7.5 U7.9 USB1.0 USB1.A1B12 USB1.B1A12 X1.2 X1.4
ADC: C14.1 R11.1 R14.2 U3.15
BAT: C17.2 CN3.2 R11.2 U1.5 U1.6 U7.8
BLK: R3.1 U3.13
C1_1: C1.1 C2.1 L5.1 U2.2
C3_1: C3.1 C4.1 FPC3.2 FPC3.15 FPC3.16 U4.3
C15_2: C15.2 L6.2 T1.1 U1.3
CAM_VDD: R13.1 U3.52 U6.1
CHA: LED1.1 U7.3
CS: FPC3.11 U3.12
DC: FPC3.12 U3.14
FPC3_17: FPC3.17 R9.2
IO0: SW1.1 U3.5
KEY: R8.1 SW3.2 U3.27
L3_1: L2.1 L3.1
L6_1: L6.1 U1.2
L_RST: FPC3.4 FPC3.8 U3.9
LCD_VDD: R12.1 U3.16 U4.1
LNA: L3.2 L4.1 U3.1
MOSI: FPC3.9 U3.10
Q1_1: Q1.1 R3.2 R4.1
Q1_3: Q1.3 R9.1
R1_2: L5.2 R1.2 R2.2 U6.3
R5_2: LED1.2 R5.2
RST: C6.1 R55.2 SW2.1 U3.4
SCL: R1.1 U2.4 U3.48
SCLK: FPC3.10 U3.11
SDA: R2.1 U2.1 U3.47
TP_INT: FPC3.3 U3.6
TP_SCL: FPC3.6 U3.8
TP_SDA: FPC3.5 U3.7
U7_6: R16.2 U7.6
U7_7: R15.2 U7.7
USB1_A5: R6.1 USB1.A5
USB1_B5: R7.2 USB1.B5
USB_D+: U3.26 USB1.A6 USB1.B6
USB_D-: U3.25 USB1.A7 USB1.B7
XTAL_N: C10.1 U3.53 X1.1
XTAL_P: C11.2 U3.54 X1.3

Pads without a net: L2 2; U1 1; U3 17 21 22 23 24 28 29 30 31 32 33 34 35 36 37 38 39 40 41 42 43 44 45 49 50 51; U7 2; USB1 A8 B8

## Via types
v1: diameter 0.5, hole 0.25, Top Layer to Bottom Layer, 105 vias
v2: diameter 0.6, hole 0.3, Top Layer to Bottom Layer, 29 vias
v3: diameter 0.7, hole 0.35, Top Layer to Bottom Layer, 2 vias
v4: diameter 0.45, hole 0.2, Top Layer to Bottom Layer, 15 vias
v5: diameter 0.62, hole 0.31, Top Layer to Bottom Layer, 1 via

## Routing (per net, layer and track width the routed paths; a pad name or vN(x,y) marks a point on that pad's centre or on a via; arc(x,y) is an arc through that point)
3V3: length 72.9
  Top Layer w0.127: v2(11.86,12.4) 11.86,12.79 11.68,12.96 11.68,15.07 11.62,15.07
  Top Layer w0.254: v2(23.55,2.06) 23.38,2.06 22.4,1.08 20.88,1.08 20.73,1.23 19.15,1.23 18.44,1.94 17.98,1.94 17.58,1.53 17.58,0.67 17.3,0.39 11.71,0.39 11.58,0.52 v2(11.58,0.8)
  Top Layer w0.381: v2(9.85,3.79) 9.85,6.35 9.69,6.51 ; v2(13.31,15.38) 13,15.07 v2(9.22,15.07) 8.92,15.07 8.92,11.92 v2(11.48,9.36) ; v2(11.48,8.04) 11.48,6.89 11.1,6.51 v2(8.61,6.51)
  Top Layer w0.635: 8.54,15.08 v2(9.22,15.07)
  Bottom Layer w0.127: R12.2 C8.1
  Bottom Layer w0.203: 12.88,8.31 13.61,8.31 13.77,8.16 13.77,7.3 ; 13.37,7.3 13.37,8.31 12.31,8.31 C7.1 ; 12.01,6.34 10.39,6.36 C12.2 ; U3.20 20.13,4.34 20.45,4.02 20.45,3.73 C16.2 ; 11.1,6.35 11.1,6.1 11.26,5.94 12.01,5.94 ; U3.19 19.78,4.74 19.96,4.56 19.96,4.34 ; 12.01,2.34 10.39,2.33
  Bottom Layer w0.254: v2(11.58,0.8) 11.58,1.14 C13.1 ; C16.2 21.82,3.03 22.07,2.78 22.07,2.51 R8.2
  Bottom Layer w0.381: v2(9.85,3.79) 9.85,2.87 10.39,2.33 ; C12.2 C20.2 ; v2(13.31,15.38) 14.64,16.7 U4.2 ; R55.1 v2(23.55,2.06) 23.33,1.84 R8.2 ; C8.1 C7.1
  Bottom Layer w0.635: U6.2 1.62,15.08 0.56,16.14 0.56,16.6
  vias: v2(8.54,15.08)
+5V: length 19.4
  Top Layer w0.381: v3(10.31,22.26) 11.53,21.04 v2(15.09,21.04) 15.42,21.04 v3(16.97,19.49)
  Bottom Layer w0.127: R5.1 10.97,25.17 10.97,23.59 C5.1
  Bottom Layer w0.33: USB1.B4A9 19.91,20.05 20.22,19.75 20.22,18.75 19.96,18.5 17.96,18.5 v3(16.97,19.49)
  Bottom Layer w0.381: C5.1 v3(10.31,22.26)
  Bottom Layer w0.6: USB1.A4B9 15.09,21.69 v2(15.09,21.04)
GND: length 7.3
  Bottom Layer w0.203: 20.83,4.9 20.58,5.14 U3.18
  Bottom Layer w0.254: U7.4 7.68,23.8 7.98,24.09 8.43,24.09 ; USB1.B1A12 20.71,22.03 22.22,22.03 23.1,22.91 ; v1(17.07,12.76) 16.25,12.76 FPC3.7
  vias: v1(0.36,24.37) v1(0.43,22.72) v1(0.61,11.54) v1(0.69,14.33) v1(1.04,19.69) v1(1.68,11.57) v1(2.34,19.67) v1(2.29,16.29) v1(2.72,11.49) v1(2.79,27.39) v1(2.82,23.48) v1(3.05,21.5) v1(3.84,18.86) v1(4.65,6.64) v1(4.67,10.02) v1(4.67,9.15) v1(4.67,8.39) v1(4.7,1) v1(5.23,6.64) v1(5.38,8.42) v1(5.54,24.7) v1(5.46,23.1) v1(5.51,21.29) v1(5.56,13.32) v1(5.63,4.17) v1(5.69,5.39) v1(6.04,6.26) v1(6.15,7.93) v1(6.17,18.91) v1(6.53,26.2) v1(6.53,24.7) v1(6.45,20) v1(6.58,21.24) v1(6.73,6.31) v1(6.76,7.88) v1(7.21,26.78) v1(7.24,25) v1(7.54,5.9) v1(7.75,16.04) v1(7.72,14.18) v1(7.93,10.4) v1(7.98,12.12) v1(8.1,18.93) v1(8.43,7.96) v1(8.38,4.2) v1(8.48,21.37) v1(8.61,5.17) v1(8.7,3) v1(9.3,1) v1(9.58,23.89) v1(9.78,14.18) v1(9.8,9.25) v1(9.8,8.04) v1(9.98,18.5) v1(10.69,5.24) v1(11.38,4.02) v1(12.88,6.11) v1(13.09,11.46) v1(14.05,17.13) v1(14.45,15.45) v1(14.46,11.38) v1(14.58,13.5) v1(14.71,8.31) v1(15.57,6.41) v1(16.23,18.68) v1(17.37,15.83) v1(17.5,16.57) v1(18.01,16.06) v1(18.49,17.87) v1(18.85,19.29) v1(18.87,8.77) v1(19,17.31) v1(19.23,11.52) v1(19.53,19.31) v1(19.63,8.75) v1(19.71,16.67) v1(19.71,3.79) v1(19.76,14.08) v1(19.84,6.97) v1(20.04,5.57) v1(21.31,22.03) v1(21.95,1.61) v1(23.27,3.34) v1(24.54,21.88) v1(25.07,2.91) v1(25.09,2.07) v1(25.7,27) v1(25.71,0.87) v1(29.7,25) v1(29.7,3) v1(30.3,27) v1(30.3,1) v2(14.3,3.74) v2(14.3,2.47) v2(14.58,4.99) v2(15.57,5.01) v2(15.57,3.74) v2(15.57,2.47) v2(16.84,5.01) v2(16.84,3.74) v2(16.84,2.47) v5(20.62,18.04)
(no net):
  vias: v1(1.14,3.92)
ADC: length 26.1
  Top Layer w0.127: v2(11.05,20.1) v2(9.93,20.1)
  Bottom Layer w0.127: R14.2 R11.1 9.91,20.13 v2(9.93,20.1) ; v2(11.05,20.1) 12.65,20.1 12.8,20.25 15.93,20.25 16.31,19.87 16.31,19.31 21.13,14.49 21.13,6.5 C14.1 20.67,6.34 19.13,6.34
BAT: length 18
  Top Layer w0.381: v2(6.48,23.2) 7.9,23.2 v2(9.4,24.7)
  Bottom Layer w0.127: 7.46,20.13 7.09,20.49 7.09,22.01 6.21,22.89 6.16,22.89
  Bottom Layer w0.381: C17.2 4.2,22.6 4.32,22.49 ; v1(2.87,22.49) 5.77,22.49 v2(6.48,23.2)
  Bottom Layer w0.508: C17.2 3.53,26.12 1.78,24.37 1.4,24.37
BLK: length 18.1
  Top Layer w0.127: v2(17.55,17.31) 17.07,17.79 v2(14.58,17.79)
  Bottom Layer w0.127: v2(17.55,17.31) 20.85,14 20.85,8.11 20.32,7.58 19.35,7.58 18.34,6.56 17.91,6.56 17.78,6.69 17.77,7.3
C1_1: length 7.7
  Bottom Layer w0.254: C2.1 7.72,8.06 8.46,8.8 8.46,10.25 8.84,10.63 9.44,10.63 L5.1
  Bottom Layer w0.381: U2.2 7.58,9.82 C1.1 C2.1
C3_1: length 14.1
  Bottom Layer w0.254: 16.24,10.25 15.56,10.25 15.21,10.6 15.21,11.66 C3.1 15.09,13.05 15.09,15.61 15.52,16.04 15.52,16.57 15.7,16.75 16.24,16.75 16.81,16.75 16.94,16.88 16.94,17.1 16.79,17.25 16.24,17.25
  Bottom Layer w0.381: U4.3 13.97,13.23 C4.1 C3.1
C15_2: length 12.9
  Bottom Layer w0.127: 0.62,21.69 0.62,21.53 0.33,21.24 0.33,19.52 1.13,18.72 1.7,18.72
  Bottom Layer w0.381: 0.81,17.45 2.38,17.45 2.72,17.79 3.84,17.79 4.7,18.65 4.7,19.4 C15.2 2.77,18.72 1.7,18.72
CAM_VDD: length 11.5
  Top Layer w0.127: v4(12.78,4.73) 13.34,5.29 13.34,8.29 10.06,11.57 v2(10.06,12.56)
  Bottom Layer w0.127: U3.52 12.02,4.73 v4(12.78,4.73) ; 10,11.97 10.06,12.04 v2(10.06,12.56) 10.06,12.96 U6.1
CHA: length 8.8
  Bottom Layer w0.127: LED1.1 4.88,26.74 4.88,24.11 5.13,23.86 6.88,23.86 7.09,23.66 7.09,22.79 7.52,22.36 8.08,22.36 8.18,22.47 8.18,23.09
CS: length 12.1
  Bottom Layer w0.127: 16.24,14.75 17.06,14.75 20.24,11.57 20.24,8.31 20.07,8.14 17.75,8.14 17.37,7.75 17.37,7.3
DC: length 12.2
  Bottom Layer w0.127: 18.17,7.3 18.17,7.69 18.34,7.86 20.17,7.86 20.57,8.26 20.57,11.64 16.97,15.25 16.24,15.25
FPC3_17: length 2.6
  Bottom Layer w0.254: 16.24,17.75 15.53,17.75 15.37,17.92 15.37,19.45 R9.2
IO0: length 18.8
  Top Layer w0.127: v2(26.31,2.19) 25.48,1.36 23.22,1.36 22.61,0.75 20.6,0.75 20.45,0.9 18.77,0.9 v4(18.21,1.46)
  Bottom Layer w0.127: v2(26.31,2.19) 26.31,2.99 v1(26.3,3) ; v4(18.21,1.46) 18.21,5.47 17.73,5.95 14.96,5.95 14.57,6.34 14.57,7.3
KEY: length 30.5
  Top Layer w0.127: v1(26.26,25.16) 24.89,25.16 24,24.27 24,21.65 23.09,20.74 21.44,20.74 21.18,20.48 21.18,2.65 v4(21.62,2.22)
  Bottom Layer w0.127: 19,1.51 20.9,1.51 v4(21.62,2.22)
  Bottom Layer w0.203: v4(21.62,2.22) 21.53,2.22 R8.1
L3_1: length 2.3
  Bottom Layer w0.349: L3.1 3.19,7.73 L2.1
  vias: v1(1.17,7.81)
L6_1: length 1.6
  Bottom Layer w0.305: U1.2 1.12,20.71 1.21,20.62 L6.1
L_RST: length 11.1
  Bottom Layer w0.127: 16.17,7.3 16.17,7.77 17.86,9.46 17.86,12.68 17.29,13.25 15.73,13.25 15.57,13.09 15.57,11.41 15.73,11.25 16.24,11.25
LCD_VDD: length 16.8
  Top Layer w0.127: v4(15.75,9.23) 17.35,7.63 v4(17.35,6.38)
  Bottom Layer w0.127: U3.16 18.22,5.94 17.93,6.23 17.78,6.23 17.63,6.38 v4(17.35,6.38) ; v4(15.75,9.23) 15.72,9.25 R12.1 14.11,10.02 12.7,10.02 12.42,10.3 12.42,13.04 12.78,13.39 13.13,13.39 13.31,13.57 13.31,14.61 12.7,15.22 12.7,16.7 U4.1
LNA: length 8.3
  Bottom Layer w0.349: L3.2 4.79,7.3 12.85,7.3
MOSI: length 8.4
  Bottom Layer w0.127: 16.24,13.75 17.22,13.75 18.11,12.86 18.11,9.31 16.57,7.77 16.57,7.3
Q1_1: length 6.5
  Bottom Layer w0.127: R3.2 12.79,18.17 10.9,18.17 10.48,18.59 Q1.1 10.31,21.37 R4.1
Q1_3: length 2.5
  Bottom Layer w0.254: Q1.3 12.07,19.54 R9.1
R1_2: length 8.5
  Bottom Layer w0.127: R1.2 R2.2 12.17,15.9 12.17,14.13 U6.3
  Bottom Layer w0.254: L5.2 10.79,11.27 10.79,12.35 U6.3
R5_2: length 4.5
  Top Layer w0.127: v1(9.83,27.42) 9.8,27.39 v1(6.3,27.39)
  Bottom Layer w0.127: LED1.2 5.83,27.39 v1(6.3,27.39) ; v1(9.83,27.42) 10.3,27.42 R5.2
RST: length 28.5
  Top Layer w0.127: v4(20.27,0.44) 23.01,0.44 23.42,0.85
  Bottom Layer w0.127: 14.17,7.3 14.17,6.69 13.34,5.85 13.34,1.66 14,1 18.21,1 18.77,0.44 v4(20.27,0.44) ; 13.42,1.57 12.14,0.29 11.28,0.29 11.05,0.52 11.05,1.18 10.87,1.36 10.19,1.36 9.55,1.99 9.09,1.99 8.71,2.37 7.24,2.37 6.6,3.01 v1(5.3,3) ; R55.2 24.1,0.85 22.95,0.85 C6.1
  vias: v2(23.42,0.85)
SCL: length 24.2
  Top Layer w0.127: v4(12.83,3.16) 12.83,3.64 13.94,4.76 13.94,8.54 10.95,11.54 10.95,13.45 v1(11.2,13.7)
  Bottom Layer w0.127: v1(11.2,13.7) 11.43,13.93 11.43,15.53 11.05,15.91 11.05,16.61 R1.1 4.74,17.53 U2.4 ; v4(12.83,3.16) 12.03,3.16 U3.48
SCLK: length 8.9
  Bottom Layer w0.127: 16.97,7.3 16.97,7.76 18.36,9.15 18.36,13.04 17.15,14.25 16.24,14.25
SDA: length 21.9
  Top Layer w0.127: v1(10.64,14.08) 10.64,11.44 13.64,8.44 13.64,4.86 12.01,3.23 v4(11.12,3.23)
  Bottom Layer w0.127: v1(10.64,14.08) 11.02,14.46 11.02,15.53 10.21,16.34 R2.1 9.76,16.7 U2.1 ; v4(11.12,3.23) 11.12,2.93 11.31,2.74 U3.47
TP_INT: length 4.9
  Bottom Layer w0.127: 16.24,10.75 16.79,10.75 16.97,10.58 16.97,9.76 14.97,7.77 14.97,7.3
TP_SCL: length 6.6
  Bottom Layer w0.127: 15.77,7.3 15.77,7.75 17.6,9.58 17.6,11.46 16.82,12.25 16.24,12.25
TP_SDA: length 6.1
  Bottom Layer w0.127: 15.37,7.3 15.37,7.76 17.35,9.74 17.35,11.21 16.81,11.75 16.24,11.75
U7_6: length 2.6
  Bottom Layer w0.127: 8.88,27.42 8.18,26.72 8.18,25.09
U7_7: length 1.2
  Bottom Layer w0.127: U7.7 8.68,26 8.88,26.2
USB1_A5: length 8.2
  Top Layer w0.127: v4(20.7,20.05) v4(18.97,20.05)
  Bottom Layer w0.127: R6.1 21.64,20.99 v4(20.7,20.05) ; USB1.A5 16.25,20.69 16.79,20.15 17.07,20.15 17.3,19.92 18.24,19.92 18.36,20.05 v4(18.97,20.05)
USB1_B5: length 9.2
  Top Layer w0.127: 20.57,20.74 v1(19.25,20.74)
  Bottom Layer w0.127: R7.2 24.55,22.58 23.62,21.65 21.82,21.65 20.88,20.71 v1(20.57,20.71) ; v1(19.25,20.74) 19.25,20.99 USB1.B5
USB_D+: length 23.7
  Top Layer w0.127: v4(20.32,2.55) 20.9,3.13 20.9,16.57 18.26,19.21 v4(18.26,20.91) v4(17.25,20.91)
  Bottom Layer w0.127: USB1.B6 18.26,21.68 v4(18.26,20.91) ; v4(20.32,2.55) 19.71,1.94 19.13,1.94 ; USB1.A6 17.25,21.69 v4(17.25,20.91)
USB_D-: length 23.6
  Top Layer w0.127: v4(20.07,3.08) 20.62,3.64 20.62,16.44 17.75,19.31 v4(17.75,20.43)
  Bottom Layer w0.127: v4(20.07,3.08) 19.84,2.85 19.84,2.47 19.71,2.34 19.13,2.34 ; USB1.A7 17.75,21.69 v4(17.75,20.43) 17.12,20.43 16.75,20.8 USB1.B7
XTAL_N: length 6.6
  Bottom Layer w0.127: 12.01,5.14 11.28,5.17 11.07,4.96 11.07,4.5 10.87,4.3 9.12,4.3 9.12,4.19 8.62,3.69 7.07,3.69 C10.1
XTAL_P: length 5.9
  Bottom Layer w0.127: C11.2 6.59,5.17 7.85,5.17 8.4,5.72 10.87,5.72 11.05,5.55 12.01,5.54

## Copper pours and planes (outline as drawn; the poured copper is in the pictures)
3V3 on Bottom Layer: 11.18,9.66 12.5,9.66 12.5,7.63 11.18,7.63
+5V on Bottom Layer: 9.04,23.43 10.74,23.43 10.74,22.51 9.04,22.51
GND on Top Layer: -4.06,30.64 36.6,30.64 36.88,30.92 36.88,-1.34 38.66,-3.11 -1.42,-3.11 -2.74,-1.79
GND on Bottom Layer: -4.06,31.4 39.88,31.4 39.98,31.5 39.98,-0.85 37.62,-3.22 -4.24,-3.22 -5,-2.45
1111 on Top Layer: 0,-0.17 0,10.98 4.34,10.98 4.39,10.93 4.39,-0.09
1111 on Bottom Layer: 0,-0.17 0,10.98 4.34,10.98 4.39,10.93 4.39,-0.09
BAT on Bottom Layer: 0.97,24.62 2.18,24.62 2.18,23.45 0.97,23.45
RST on Bottom Layer: 22.35,1.13 24.51,1.13 24.51,0.54 22.35,0.54

Small or netless copper shapes (teardrops, artwork), in the pictures only: 3 on Bottom Layer

## Text on the board
Bottom Silkscreen Layer: + | 1 | 18 | -
Top Silkscreen Layer: BAT | + | - | RST | QF-HEYE | 23-12-15 V1.1.0 | DOWN | UP | 详细说明查看原理图和用户手册！ | 0402、0603固件、外壳通用 | PCB打0.8mm厚
